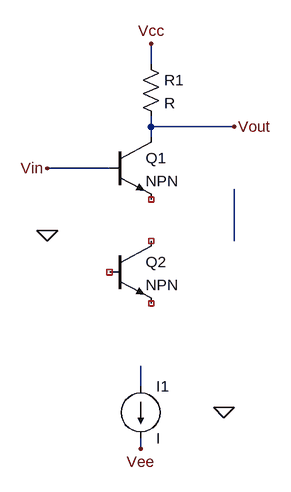
[diagram p0: schematic catabilemmnefollower.asc]
catabilemmnefollower.asc, the LTspice schematic file:
Version 4
SHEET 1 880 680
WIRE 144 -32 144 -64
WIRE 144 64 144 48
WIRE 272 64 144 64
WIRE 144 80 144 64
WIRE 80 128 -16 128
WIRE 272 240 272 160
WIRE 128 464 128 432
WIRE 128 560 128 544
FLAG -16 224 0
FLAG 256 496 0
FLAG 128 560 Vee
FLAG 144 -64 Vcc
FLAG -16 128 Vin
FLAG 272 64 Vout
SYMBOL npn 80 80 R0
SYMATTR InstName Q1
SYMBOL res 128 -48 R0
SYMATTR InstName R1
SYMBOL current 128 464 R0
SYMATTR InstName I1
SYMBOL npn 80 240 R0
SYMATTR InstName Q2

The netlist it stands for:
* catabilemmnefollower.asc
Q1 Vout Vin NC_01 0 NPN
R1 Vcc Vout R
I1 N002 Vee I
Q2 NC_02 NC_03 NC_04 0 NPN
.model NPN NPN
.model PNP PNP
.lib standard.bjt
.backanno
.end